# EAGLE board FMCtoEdgeLS_R (EAGLE 9.6.2), part 1 of 2
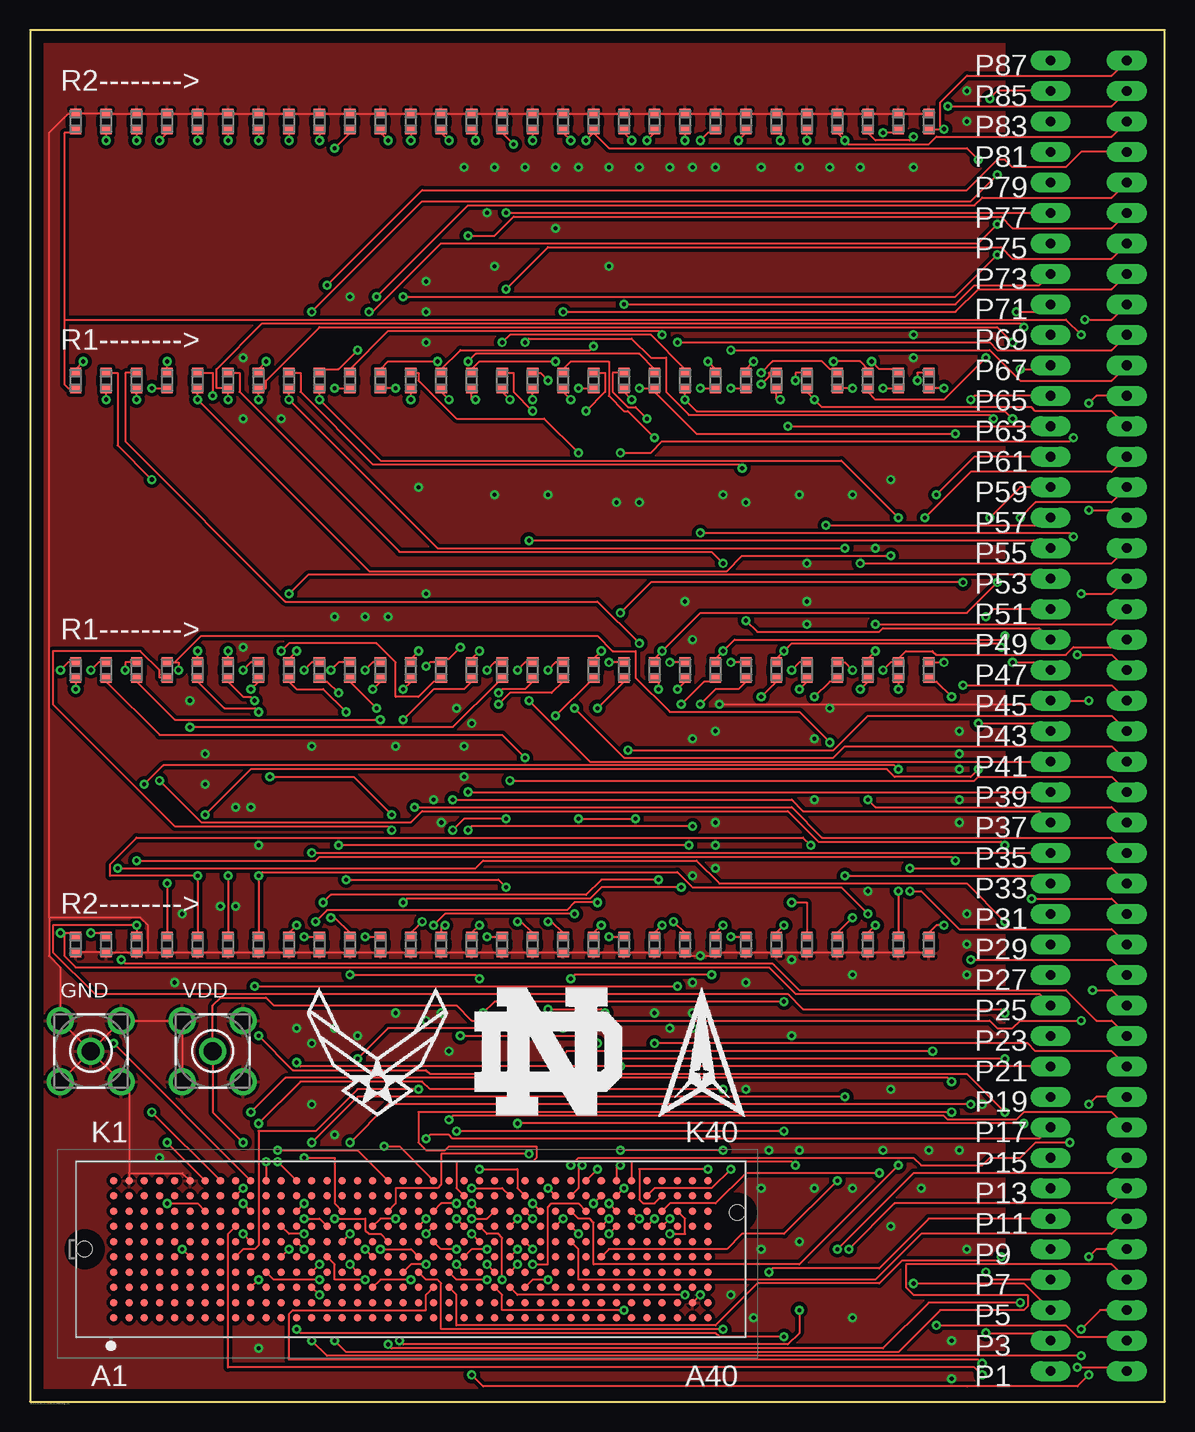
[diagram p3: board, top side]
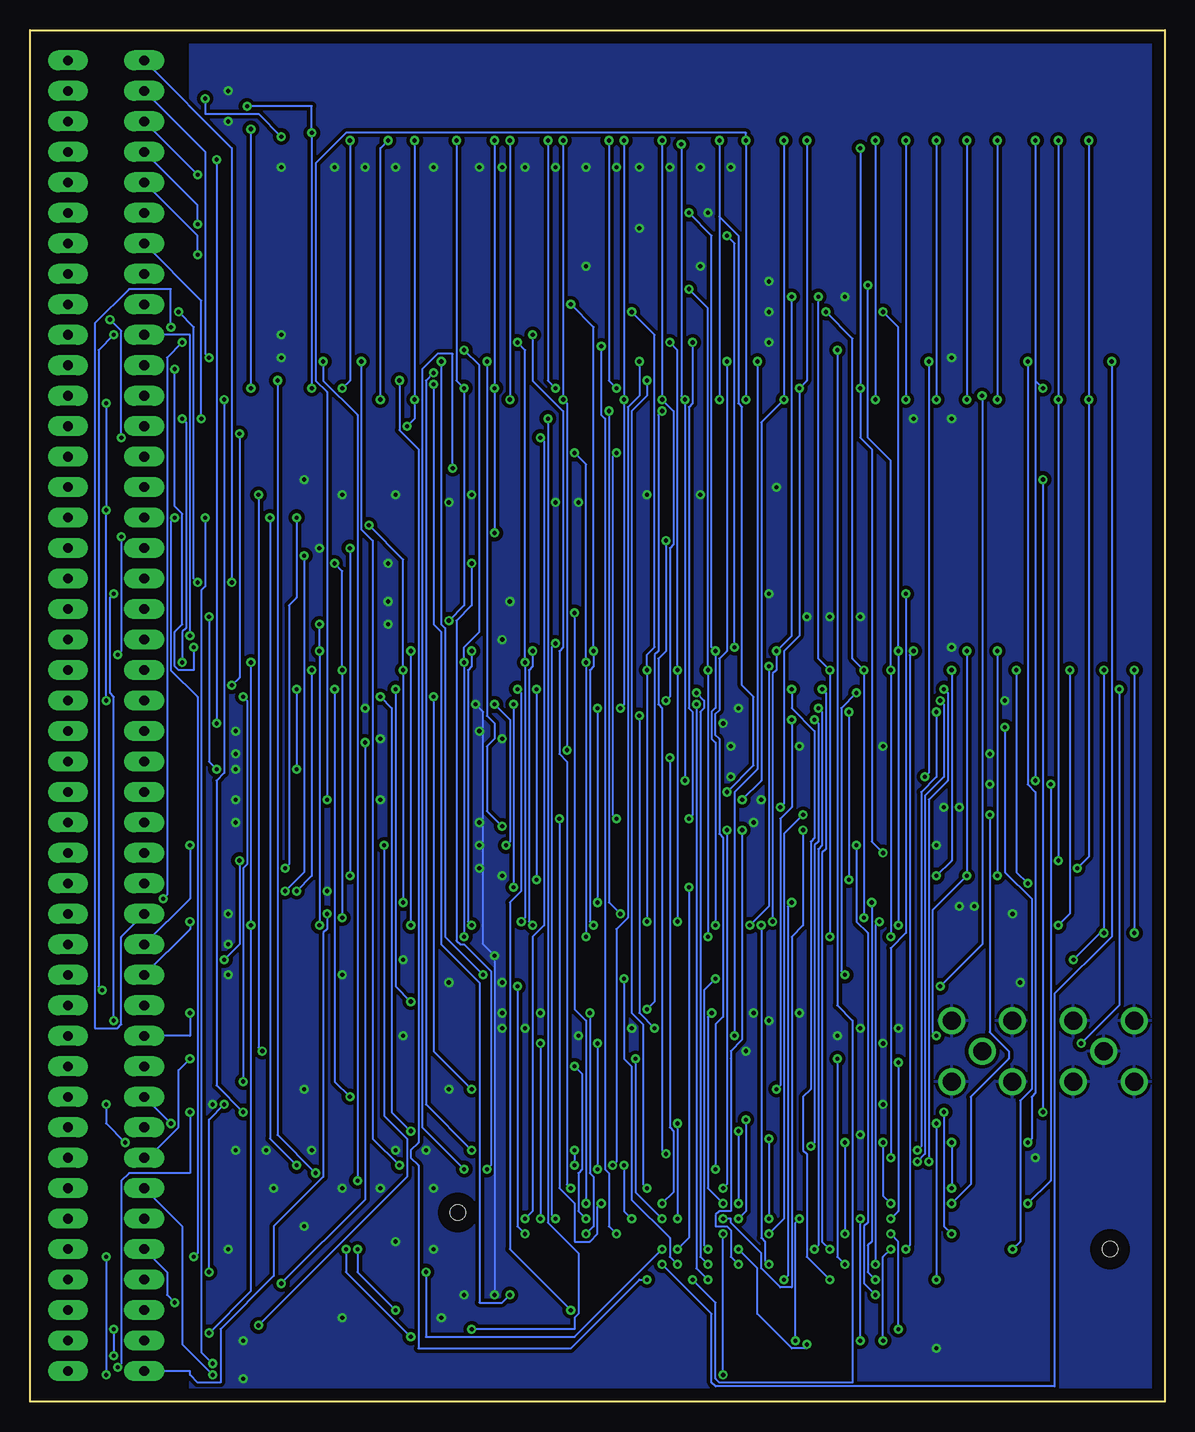
[diagram p4: board, bottom side, seen from below]

Size 94.61 x 114.3 mm. Coordinates in mm from the lower left corner, seen from the top.
Outline: 0,0 94.61,0 94.61,114.3 0,114.3 0,0
Copper layers (1*16): Top 0.035mm / dielectric 1.5mm / Bottom 0.035mm
Design rules "default *": minimum track width 6mil, minimum drill 0.35mm, track to track 6mil, track to pad 6mil, pad to pad 6mil, via to via 6mil, smd to smd 6mil, copper to edge 40mil, drill to drill 6mil, minimum pad ring 10mil, minimum via ring 8mil, stop-mask expansion 4mil, vias tented up to drill 14mm, thermal gap 10mil

## Footprints (pad centres in the part's own frame; a part is rotated, then mirrored left to right if it is on the bottom)
LTI-SASF54GT = drill 1.5 pad 2.2: 1 0,0; 2 -2.54,2.54; 3 2.54,2.54; 4 2.54,-2.54; 5 -2.54,-2.54
ASP13460201 = smd 0.64 x 0.64: A1 24.765,5.715; A2 23.495,5.715; A3 22.225,5.715; A4 20.955,5.715; A5 19.685,5.715; A6 18.415,5.715; A7 17.145,5.715; A8 15.875,5.715; A9 14.605,5.715; A10 13.335,5.715; A11 12.065,5.715; A12 10.795,5.715; A13 9.525,5.715; A14 8.255,5.715; A15 6.985,5.715; A16 5.715,5.715; A17 4.445,5.715; A18 3.175,5.715; A19 1.905,5.715; A20 0.635,5.715; A21 -0.635,5.715; A22 -1.905,5.715; A23 -3.175,5.715; A24 -4.445,5.715; A25 -5.715,5.715; A26 -6.985,5.715; A27 -8.255,5.715; A28 -9.525,5.715; A29 -10.795,5.715; A30 -12.065,5.715; A31 -13.335,5.715; A32 -14.605,5.715; A33 -15.875,5.715; A34 -17.145,5.715; A35 -18.415,5.715; A36 -19.685,5.715; A37 -20.955,5.715; A38 -22.225,5.715; A39 -23.495,5.715; A40 -24.765,5.715; B1 24.765,4.445; B2 23.495,4.445; B3 22.225,4.445; B4 20.955,4.445; B5 19.685,4.445; B6 18.415,4.445; B7 17.145,4.445; B8 15.875,4.445; B9 14.605,4.445; B10 13.335,4.445; B11 12.065,4.445; B12 10.795,4.445; B13 9.525,4.445; B14 8.255,4.445; B15 6.985,4.445; B16 5.715,4.445; B17 4.445,4.445; B18 3.175,4.445; B19 1.905,4.445; B20 0.635,4.445; B21 -0.635,4.445; B22 -1.905,4.445; B23 -3.175,4.445; B24 -4.445,4.445; B25 -5.715,4.445; B26 -6.985,4.445; B27 -8.255,4.445; B28 -9.525,4.445; B29 -10.795,4.445; B30 -12.065,4.445; B31 -13.335,4.445; B32 -14.605,4.445; B33 -15.875,4.445; B34 -17.145,4.445; B35 -18.415,4.445; B36 -19.685,4.445; B37 -20.955,4.445; B38 -22.225,4.445; B39 -23.495,4.445; B40 -24.765,4.445; C1 24.765,3.175; C2 23.495,3.175; C3 22.225,3.175; C4 20.955,3.175; C5 19.685,3.175; C6 18.415,3.175; C7 17.145,3.175; C8 15.875,3.175; C9 14.605,3.175; C10 13.335,3.175; C11 12.065,3.175; C12 10.795,3.175; C13 9.525,3.175; C14 8.255,3.175; C15 6.985,3.175; C16 5.715,3.175; C17 4.445,3.175; C18 3.175,3.175; C19 1.905,3.175; C20 0.635,3.175; C21 -0.635,3.175; C22 -1.905,3.175; C23 -3.175,3.175; C24 -4.445,3.175; C25 -5.715,3.175; C26 -6.985,3.175; C27 -8.255,3.175; C28 -9.525,3.175; C29 -10.795,3.175; C30 -12.065,3.175; C31 -13.335,3.175; C32 -14.605,3.175; C33 -15.875,3.175; C34 -17.145,3.175; C35 -18.415,3.175; C36 -19.685,3.175; C37 -20.955,3.175; C38 -22.225,3.175; C39 -23.495,3.175; C40 -24.765,3.175; D1 24.765,1.905; D2 23.495,1.905; D3 22.225,1.905; D4 20.955,1.905; D5 19.685,1.905; D6 18.415,1.905; D7 17.145,1.905; D8 15.875,1.905; D9 14.605,1.905; D10 13.335,1.905; D11 12.065,1.905; D12 10.795,1.905; D13 9.525,1.905; D14 8.255,1.905; D15 6.985,1.905; D16 5.715,1.905; D17 4.445,1.905; D18 3.175,1.905; D19 1.905,1.905; D20 0.635,1.905; D21 -0.635,1.905; D22 -1.905,1.905; D23 -3.175,1.905; D24 -4.445,1.905; D25 -5.715,1.905; D26 -6.985,1.905; D27 -8.255,1.905; D28 -9.525,1.905; D29 -10.795,1.905; D30 -12.065,1.905; D31 -13.335,1.905; D32 -14.605,1.905; D33 -15.875,1.905; D34 -17.145,1.905; D35 -18.415,1.905; D36 -19.685,1.905; D37 -20.955,1.905; D38 -22.225,1.905; D39 -23.495,1.905; D40 -24.765,1.905; E1 24.765,0.635; E2 23.495,0.635; E3 22.225,0.635; E4 20.955,0.635; E5 19.685,0.635; E6 18.415,0.635; E7 17.145,0.635; E8 15.875,0.635; E9 14.605,0.635; E10 13.335,0.635; E11 12.065,0.635; E12 10.795,0.635; E13 9.525,0.635; E14 8.255,0.635; E15 6.985,0.635; E16 5.715,0.635; E17 4.445,0.635; E18 3.175,0.635; E19 1.905,0.635; E20 0.635,0.635; E21 -0.635,0.635; E22 -1.905,0.635; E23 -3.175,0.635; E24 -4.445,0.635; E25 -5.715,0.635; E26 -6.985,0.635; E27 -8.255,0.635; E28 -9.525,0.635; E29 -10.795,0.635; E30 -12.065,0.635; E31 -13.335,0.635; E32 -14.605,0.635; E33 -15.875,0.635; E34 -17.145,0.635; E35 -18.415,0.635; E36 -19.685,0.635; E37 -20.955,0.635; E38 -22.225,0.635; E39 -23.495,0.635; E40 -24.765,0.635; F1 24.765,-0.635; F2 23.495,-0.635; F3 22.225,-0.635; F4 20.955,-0.635; F5 19.685,-0.635; F6 18.415,-0.635; F7 17.145,-0.635; F8 15.875,-0.635; F9 14.605,-0.635; F10 13.335,-0.635; F11 12.065,-0.635; F12 10.795,-0.635; F13 9.525,-0.635; F14 8.255,-0.635; F15 6.985,-0.635; F16 5.715,-0.635; F17 4.445,-0.635; F18 3.175,-0.635; F19 1.905,-0.635; F20 0.635,-0.635; F21 -0.635,-0.635; F22 -1.905,-0.635; F23 -3.175,-0.635; F24 -4.445,-0.635; F25 -5.715,-0.635; F26 -6.985,-0.635; F27 -8.255,-0.635; F28 -9.525,-0.635; F29 -10.795,-0.635; F30 -12.065,-0.635; F31 -13.335,-0.635; F32 -14.605,-0.635; F33 -15.875,-0.635; F34 -17.145,-0.635; F35 -18.415,-0.635; F36 -19.685,-0.635; F37 -20.955,-0.635; F38 -22.225,-0.635; F39 -23.495,-0.635; F40 -24.765,-0.635; G1 24.765,-1.905; G2 23.495,-1.905; G3 22.225,-1.905; G4 20.955,-1.905; G5 19.685,-1.905; G6 18.415,-1.905; G7 17.145,-1.905; G8 15.875,-1.905; G9 14.605,-1.905; G10 13.335,-1.905; G11 12.065,-1.905; G12 10.795,-1.905; G13 9.525,-1.905; G14 8.255,-1.905; G15 6.985,-1.905; G16 5.715,-1.905; G17 4.445,-1.905; G18 3.175,-1.905; G19 1.905,-1.905; G20 0.635,-1.905; G21 -0.635,-1.905; G22 -1.905,-1.905; G23 -3.175,-1.905; G24 -4.445,-1.905; G25 -5.715,-1.905; G26 -6.985,-1.905; G27 -8.255,-1.905; G28 -9.525,-1.905; G29 -10.795,-1.905; G30 -12.065,-1.905; G31 -13.335,-1.905; G32 -14.605,-1.905; G33 -15.875,-1.905; G34 -17.145,-1.905; G35 -18.415,-1.905; G36 -19.685,-1.905; G37 -20.955,-1.905; G38 -22.225,-1.905; G39 -23.495,-1.905; G40 -24.765,-1.905; H1 24.765,-3.175; H2 23.495,-3.175; H3 22.225,-3.175; H4 20.955,-3.175; H5 19.685,-3.175; H6 18.415,-3.175; H7 17.145,-3.175; H8 15.875,-3.175; H9 14.605,-3.175; H10 13.335,-3.175; H11 12.065,-3.175; H12 10.795,-3.175; H13 9.525,-3.175; H14 8.255,-3.175; H15 6.985,-3.175; H16 5.715,-3.175; H17 4.445,-3.175; H18 3.175,-3.175; H19 1.905,-3.175; H20 0.635,-3.175; H21 -0.635,-3.175; H22 -1.905,-3.175; H23 -3.175,-3.175; H24 -4.445,-3.175; H25 -5.715,-3.175; H26 -6.985,-3.175; H27 -8.255,-3.175; H28 -9.525,-3.175; H29 -10.795,-3.175; H30 -12.065,-3.175; H31 -13.335,-3.175; H32 -14.605,-3.175; H33 -15.875,-3.175; H34 -17.145,-3.175; H35 -18.415,-3.175; H36 -19.685,-3.175; H37 -20.955,-3.175; H38 -22.225,-3.175; H39 -23.495,-3.175; H40 -24.765,-3.175; J1 24.765,-4.445; J2 23.495,-4.445; J3 22.225,-4.445; J4 20.955,-4.445; J5 19.685,-4.445; J6 18.415,-4.445; J7 17.145,-4.445; J8 15.875,-4.445; J9 14.605,-4.445; J10 13.335,-4.445; J11 12.065,-4.445; J12 10.795,-4.445; J13 9.525,-4.445; J14 8.255,-4.445; J15 6.985,-4.445; J16 5.715,-4.445; J17 4.445,-4.445; J18 3.175,-4.445; J19 1.905,-4.445; J20 0.635,-4.445; J21 -0.635,-4.445; J22 -1.905,-4.445; J23 -3.175,-4.445; J24 -4.445,-4.445; J25 -5.715,-4.445; J26 -6.985,-4.445; J27 -8.255,-4.445; J28 -9.525,-4.445; J29 -10.795,-4.445; J30 -12.065,-4.445; J31 -13.335,-4.445; J32 -14.605,-4.445; J33 -15.875,-4.445; J34 -17.145,-4.445; J35 -18.415,-4.445; J36 -19.685,-4.445; J37 -20.955,-4.445; J38 -22.225,-4.445; J39 -23.495,-4.445; J40 -24.765,-4.445; K1 24.765,-5.715; K2 23.495,-5.715; K3 22.225,-5.715; K4 20.955,-5.715; K5 19.685,-5.715; K6 18.415,-5.715; K7 17.145,-5.715; K8 15.875,-5.715; K9 14.605,-5.715; K10 13.335,-5.715; K11 12.065,-5.715; K12 10.795,-5.715; K13 9.525,-5.715; K14 8.255,-5.715; K15 6.985,-5.715; K16 5.715,-5.715; K17 4.445,-5.715; K18 3.175,-5.715; K19 1.905,-5.715; K20 0.635,-5.715; K21 -0.635,-5.715; K22 -1.905,-5.715; K23 -3.175,-5.715; K24 -4.445,-5.715; K25 -5.715,-5.715; K26 -6.985,-5.715; K27 -8.255,-5.715; K28 -9.525,-5.715; K29 -10.795,-5.715; K30 -12.065,-5.715; K31 -13.335,-5.715; K32 -14.605,-5.715; K33 -15.875,-5.715; K34 -17.145,-5.715; K35 -18.415,-5.715; K36 -19.685,-5.715; K37 -20.955,-5.715; K38 -22.225,-5.715; K39 -23.495,-5.715; K40 -24.765,-5.715 | hole 1.27: -27.19,-3.05; 27.19,0
EDGEPADS(THRU) = drill 0.8 pad 1.676 long: P$1 3.81,0; P$2 10.16,0; P$3 3.81,2.54; P$4 10.16,2.54; P$5 3.81,5.08; P$6 10.16,5.08; P$7 3.81,7.62; P$8 10.16,7.62; P$9 3.81,10.16; P$10 10.16,10.16; P$11 3.81,12.7; P$12 10.16,12.7; P$13 3.81,15.24; P$14 10.16,15.24; P$15 3.81,17.78; P$16 10.16,17.78; P$17 3.81,20.32; P$18 10.16,20.32; P$19 3.81,22.86; P$20 10.16,22.86; P$21 3.81,25.4; P$22 10.16,25.4; P$23 3.81,27.94; P$24 10.16,27.94; P$25 3.81,30.48; P$26 10.16,30.48; P$27 3.81,33.02; P$28 10.16,33.02; P$29 3.81,35.56; P$30 10.16,35.56; P$31 3.81,38.1; P$32 10.16,38.1; P$33 3.81,40.64; P$34 10.16,40.64; P$35 3.81,43.18; P$36 10.16,43.18; P$37 3.81,45.72; P$38 10.16,45.72; P$39 3.81,48.26; P$40 10.16,48.26; P$41 3.81,50.8; P$42 10.16,50.8; P$43 3.81,53.34; P$44 10.16,53.34; P$45 3.81,55.88; P$46 10.16,55.88; P$47 3.81,58.42; P$48 10.16,58.42; P$49 3.81,60.96; P$50 10.16,60.96; P$51 3.81,63.5; P$52 10.16,63.5; P$53 3.81,66.04; P$54 10.16,66.04; P$55 3.81,68.58; P$56 10.16,68.58; P$57 3.81,71.12; P$58 10.16,71.12; P$59 3.81,73.66; P$60 10.16,73.66; P$61 3.81,76.2; P$62 10.16,76.2; P$63 3.81,78.74; P$64 10.16,78.74; P$65 3.81,81.28; P$66 10.16,81.28; P$67 3.81,83.82; P$68 10.16,83.82; P$69 3.81,86.36; P$70 10.16,86.36; P$71 3.81,88.9; P$72 10.16,88.9; P$73 3.81,91.44; P$74 10.16,91.44; P$75 3.81,93.98; P$76 10.16,93.98; P$77 3.81,96.52; P$78 10.16,96.52; P$79 3.81,99.06; P$80 10.16,99.06; P$81 3.81,101.6; P$82 10.16,101.6; P$83 3.81,104.14; P$84 10.16,104.14; P$85 3.81,106.68; P$86 10.16,106.68; P$87 3.81,109.22; P$88 10.16,109.22
STA_RMCF0603_STP = smd 0.711 x 0.94: 1 -0.699,0; 2 0.699,0

## Placement (x,y rotation side)
GND  LTI-SASF54GT  [LTI-SASF54GT]  5.08,29.21 0 top
J1  ASP-134602-01  [ASP13460201]  31.75,12.7 180 top
U$1  EDGEPADS(THRU)  [EDGEPADS(THRU)]  81.28,2.54 0 top
VD1:R1  RMCF0603ZT0R00  [STA_RMCF0603_STP]  74.93,60.96 90 top
VD1:R2  RMCF0603ZT0R00  [STA_RMCF0603_STP]  74.93,38.1 90 top
VD2:R1  RMCF0603ZT0R00  [STA_RMCF0603_STP]  72.39,60.96 90 top
VD2:R2  RMCF0603ZT0R00  [STA_RMCF0603_STP]  72.39,38.1 90 top
VD3:R1  RMCF0603ZT0R00  [STA_RMCF0603_STP]  69.85,60.96 90 top
VD3:R2  RMCF0603ZT0R00  [STA_RMCF0603_STP]  69.85,38.1 90 top
VD4:R1  RMCF0603ZT0R00  [STA_RMCF0603_STP]  67.31,60.96 90 top
VD4:R2  RMCF0603ZT0R00  [STA_RMCF0603_STP]  67.31,38.1 90 top
VD5:R1  RMCF0603ZT0R00  [STA_RMCF0603_STP]  64.77,60.96 90 top
VD5:R2  RMCF0603ZT0R00  [STA_RMCF0603_STP]  64.77,38.1 90 top
VD6:R1  RMCF0603ZT0R00  [STA_RMCF0603_STP]  62.23,60.96 90 top
VD6:R2  RMCF0603ZT0R00  [STA_RMCF0603_STP]  62.23,38.1 90 top
VD7:R1  RMCF0603ZT0R00  [STA_RMCF0603_STP]  59.69,60.96 90 top
VD7:R2  RMCF0603ZT0R00  [STA_RMCF0603_STP]  59.69,38.1 90 top
VD8:R1  RMCF0603ZT0R00  [STA_RMCF0603_STP]  57.15,60.96 90 top
VD8:R2  RMCF0603ZT0R00  [STA_RMCF0603_STP]  57.15,38.1 90 top
VD9:R1  RMCF0603ZT0R00  [STA_RMCF0603_STP]  54.61,60.96 90 top
VD9:R2  RMCF0603ZT0R00  [STA_RMCF0603_STP]  54.61,38.1 90 top
VD10:R1  RMCF0603ZT0R00  [STA_RMCF0603_STP]  52.07,60.96 90 top
VD10:R2  RMCF0603ZT0R00  [STA_RMCF0603_STP]  52.07,38.1 90 top
VD11:R1  RMCF0603ZT0R00  [STA_RMCF0603_STP]  49.53,60.96 90 top
VD11:R2  RMCF0603ZT0R00  [STA_RMCF0603_STP]  49.53,38.1 90 top
VD12:R1  RMCF0603ZT0R00  [STA_RMCF0603_STP]  46.99,60.96 90 top
VD12:R2  RMCF0603ZT0R00  [STA_RMCF0603_STP]  46.99,38.1 90 top
VD13:R1  RMCF0603ZT0R00  [STA_RMCF0603_STP]  44.45,60.96 90 top
VD13:R2  RMCF0603ZT0R00  [STA_RMCF0603_STP]  44.45,38.1 90 top
VD14:R1  RMCF0603ZT0R00  [STA_RMCF0603_STP]  41.91,60.96 90 top
VD14:R2  RMCF0603ZT0R00  [STA_RMCF0603_STP]  41.91,38.1 90 top
VD15:R1  RMCF0603ZT0R00  [STA_RMCF0603_STP]  39.37,60.96 90 top
VD15:R2  RMCF0603ZT0R00  [STA_RMCF0603_STP]  39.37,38.1 90 top
VD16:R1  RMCF0603ZT0R00  [STA_RMCF0603_STP]  36.83,60.96 90 top
VD16:R2  RMCF0603ZT0R00  [STA_RMCF0603_STP]  36.83,38.1 90 top
VD17:R1  RMCF0603ZT0R00  [STA_RMCF0603_STP]  34.29,60.96 90 top
VD17:R2  RMCF0603ZT0R00  [STA_RMCF0603_STP]  34.29,38.1 90 top
VD18:R1  RMCF0603ZT0R00  [STA_RMCF0603_STP]  31.75,60.96 90 top
VD18:R2  RMCF0603ZT0R00  [STA_RMCF0603_STP]  31.75,38.1 90 top
VD19:R1  RMCF0603ZT0R00  [STA_RMCF0603_STP]  29.21,60.96 90 top
VD19:R2  RMCF0603ZT0R00  [STA_RMCF0603_STP]  29.21,38.1 90 top
VD20:R1  RMCF0603ZT0R00  [STA_RMCF0603_STP]  26.67,60.96 90 top
VD20:R2  RMCF0603ZT0R00  [STA_RMCF0603_STP]  26.67,38.1 90 top
VD21:R1  RMCF0603ZT0R00  [STA_RMCF0603_STP]  24.13,60.96 90 top
VD21:R2  RMCF0603ZT0R00  [STA_RMCF0603_STP]  24.13,38.1 90 top
VD22:R1  RMCF0603ZT0R00  [STA_RMCF0603_STP]  21.59,60.96 90 top
VD22:R2  RMCF0603ZT0R00  [STA_RMCF0603_STP]  21.59,38.1 90 top
VD23:R1  RMCF0603ZT0R00  [STA_RMCF0603_STP]  19.05,60.96 90 top
VD23:R2  RMCF0603ZT0R00  [STA_RMCF0603_STP]  19.05,38.1 90 top
VD24:R1  RMCF0603ZT0R00  [STA_RMCF0603_STP]  16.51,60.96 90 top
VD24:R2  RMCF0603ZT0R00  [STA_RMCF0603_STP]  16.51,38.1 90 top
VD25:R1  RMCF0603ZT0R00  [STA_RMCF0603_STP]  13.97,60.96 90 top
VD25:R2  RMCF0603ZT0R00  [STA_RMCF0603_STP]  13.97,38.1 90 top
VD26:R1  RMCF0603ZT0R00  [STA_RMCF0603_STP]  11.43,60.96 90 top
VD26:R2  RMCF0603ZT0R00  [STA_RMCF0603_STP]  11.43,38.1 90 top
VD27:R1  RMCF0603ZT0R00  [STA_RMCF0603_STP]  8.89,60.96 90 top
VD27:R2  RMCF0603ZT0R00  [STA_RMCF0603_STP]  8.89,38.1 90 top
VD28:R1  RMCF0603ZT0R00  [STA_RMCF0603_STP]  6.35,60.96 90 top
VD28:R2  RMCF0603ZT0R00  [STA_RMCF0603_STP]  6.35,38.1 90 top
VD29:R1  RMCF0603ZT0R00  [STA_RMCF0603_STP]  3.81,60.96 90 top
VD29:R2  RMCF0603ZT0R00  [STA_RMCF0603_STP]  3.81,38.1 90 top
VD30:R1  RMCF0603ZT0R00  [STA_RMCF0603_STP]  3.81,85.09 270 top
VD30:R2  RMCF0603ZT0R00  [STA_RMCF0603_STP]  3.81,106.68 270 top
VD31:R1  RMCF0603ZT0R00  [STA_RMCF0603_STP]  6.35,85.09 270 top
VD31:R2  RMCF0603ZT0R00  [STA_RMCF0603_STP]  6.35,106.68 270 top
VD32:R1  RMCF0603ZT0R00  [STA_RMCF0603_STP]  8.89,85.09 270 top
VD32:R2  RMCF0603ZT0R00  [STA_RMCF0603_STP]  8.89,106.68 270 top
VD33:R1  RMCF0603ZT0R00  [STA_RMCF0603_STP]  11.43,85.09 270 top
VD33:R2  RMCF0603ZT0R00  [STA_RMCF0603_STP]  11.43,106.68 270 top
VD34:R1  RMCF0603ZT0R00  [STA_RMCF0603_STP]  13.97,85.09 270 top
VD34:R2  RMCF0603ZT0R00  [STA_RMCF0603_STP]  13.97,106.68 270 top
VD35:R1  RMCF0603ZT0R00  [STA_RMCF0603_STP]  16.51,85.09 270 top
VD35:R2  RMCF0603ZT0R00  [STA_RMCF0603_STP]  16.51,106.68 270 top
VD36:R1  RMCF0603ZT0R00  [STA_RMCF0603_STP]  19.05,85.09 270 top
VD36:R2  RMCF0603ZT0R00  [STA_RMCF0603_STP]  19.05,106.68 270 top
VD37:R1  RMCF0603ZT0R00  [STA_RMCF0603_STP]  21.59,85.09 270 top
VD37:R2  RMCF0603ZT0R00  [STA_RMCF0603_STP]  21.59,106.68 270 top
VD38:R1  RMCF0603ZT0R00  [STA_RMCF0603_STP]  24.13,85.09 270 top
VD38:R2  RMCF0603ZT0R00  [STA_RMCF0603_STP]  24.13,106.68 270 top
VD39:R1  RMCF0603ZT0R00  [STA_RMCF0603_STP]  26.67,85.09 270 top
VD39:R2  RMCF0603ZT0R00  [STA_RMCF0603_STP]  26.67,106.68 270 top
VD40:R1  RMCF0603ZT0R00  [STA_RMCF0603_STP]  29.21,85.09 270 top
VD40:R2  RMCF0603ZT0R00  [STA_RMCF0603_STP]  29.21,106.68 270 top
VD41:R1  RMCF0603ZT0R00  [STA_RMCF0603_STP]  31.75,85.09 270 top
VD41:R2  RMCF0603ZT0R00  [STA_RMCF0603_STP]  31.75,106.68 270 top
VD42:R1  RMCF0603ZT0R00  [STA_RMCF0603_STP]  34.29,85.09 270 top
VD42:R2  RMCF0603ZT0R00  [STA_RMCF0603_STP]  34.29,106.68 270 top
VD43:R1  RMCF0603ZT0R00  [STA_RMCF0603_STP]  36.83,85.09 270 top
VD43:R2  RMCF0603ZT0R00  [STA_RMCF0603_STP]  36.83,106.68 270 top
VD44:R1  RMCF0603ZT0R00  [STA_RMCF0603_STP]  39.37,85.09 270 top
VD44:R2  RMCF0603ZT0R00  [STA_RMCF0603_STP]  39.37,106.68 270 top
VD45:R1  RMCF0603ZT0R00  [STA_RMCF0603_STP]  41.91,85.09 270 top
VD45:R2  RMCF0603ZT0R00  [STA_RMCF0603_STP]  41.91,106.68 270 top
VD46:R1  RMCF0603ZT0R00  [STA_RMCF0603_STP]  44.45,85.09 270 top
VD46:R2  RMCF0603ZT0R00  [STA_RMCF0603_STP]  44.45,106.68 270 top
VD47:R1  RMCF0603ZT0R00  [STA_RMCF0603_STP]  46.99,85.09 270 top
VD47:R2  RMCF0603ZT0R00  [STA_RMCF0603_STP]  46.99,106.68 270 top
VD48:R1  RMCF0603ZT0R00  [STA_RMCF0603_STP]  49.53,85.09 270 top
VD48:R2  RMCF0603ZT0R00  [STA_RMCF0603_STP]  49.53,106.68 270 top
VD49:R1  RMCF0603ZT0R00  [STA_RMCF0603_STP]  52.07,85.09 270 top
VD49:R2  RMCF0603ZT0R00  [STA_RMCF0603_STP]  52.07,106.68 270 top
VD50:R1  RMCF0603ZT0R00  [STA_RMCF0603_STP]  54.61,85.09 270 top
VD50:R2  RMCF0603ZT0R00  [STA_RMCF0603_STP]  54.61,106.68 270 top
VD51:R1  RMCF0603ZT0R00  [STA_RMCF0603_STP]  57.15,85.09 270 top
VD51:R2  RMCF0603ZT0R00  [STA_RMCF0603_STP]  57.15,106.68 270 top
VD52:R1  RMCF0603ZT0R00  [STA_RMCF0603_STP]  59.69,85.09 270 top
VD52:R2  RMCF0603ZT0R00  [STA_RMCF0603_STP]  59.69,106.68 270 top
VD53:R1  RMCF0603ZT0R00  [STA_RMCF0603_STP]  62.23,85.09 270 top
VD53:R2  RMCF0603ZT0R00  [STA_RMCF0603_STP]  62.23,106.68 270 top
VD54:R1  RMCF0603ZT0R00  [STA_RMCF0603_STP]  64.77,85.09 270 top
VD54:R2  RMCF0603ZT0R00  [STA_RMCF0603_STP]  64.77,106.68 270 top
VD55:R1  RMCF0603ZT0R00  [STA_RMCF0603_STP]  67.31,85.09 270 top
VD55:R2  RMCF0603ZT0R00  [STA_RMCF0603_STP]  67.31,106.68 270 top
VD56:R1  RMCF0603ZT0R00  [STA_RMCF0603_STP]  69.85,85.09 270 top
VD56:R2  RMCF0603ZT0R00  [STA_RMCF0603_STP]  69.85,106.68 270 top
VD57:R1  RMCF0603ZT0R00  [STA_RMCF0603_STP]  72.39,85.09 270 top
VD57:R2  RMCF0603ZT0R00  [STA_RMCF0603_STP]  72.39,106.68 270 top
VD58:R1  RMCF0603ZT0R00  [STA_RMCF0603_STP]  74.93,85.09 270 top
VD58:R2  RMCF0603ZT0R00  [STA_RMCF0603_STP]  74.93,106.68 270 top
VDD  LTI-SASF54GT  [LTI-SASF54GT]  15.24,29.21 0 top